# Altium project ECS_V1.06.PrjPcb
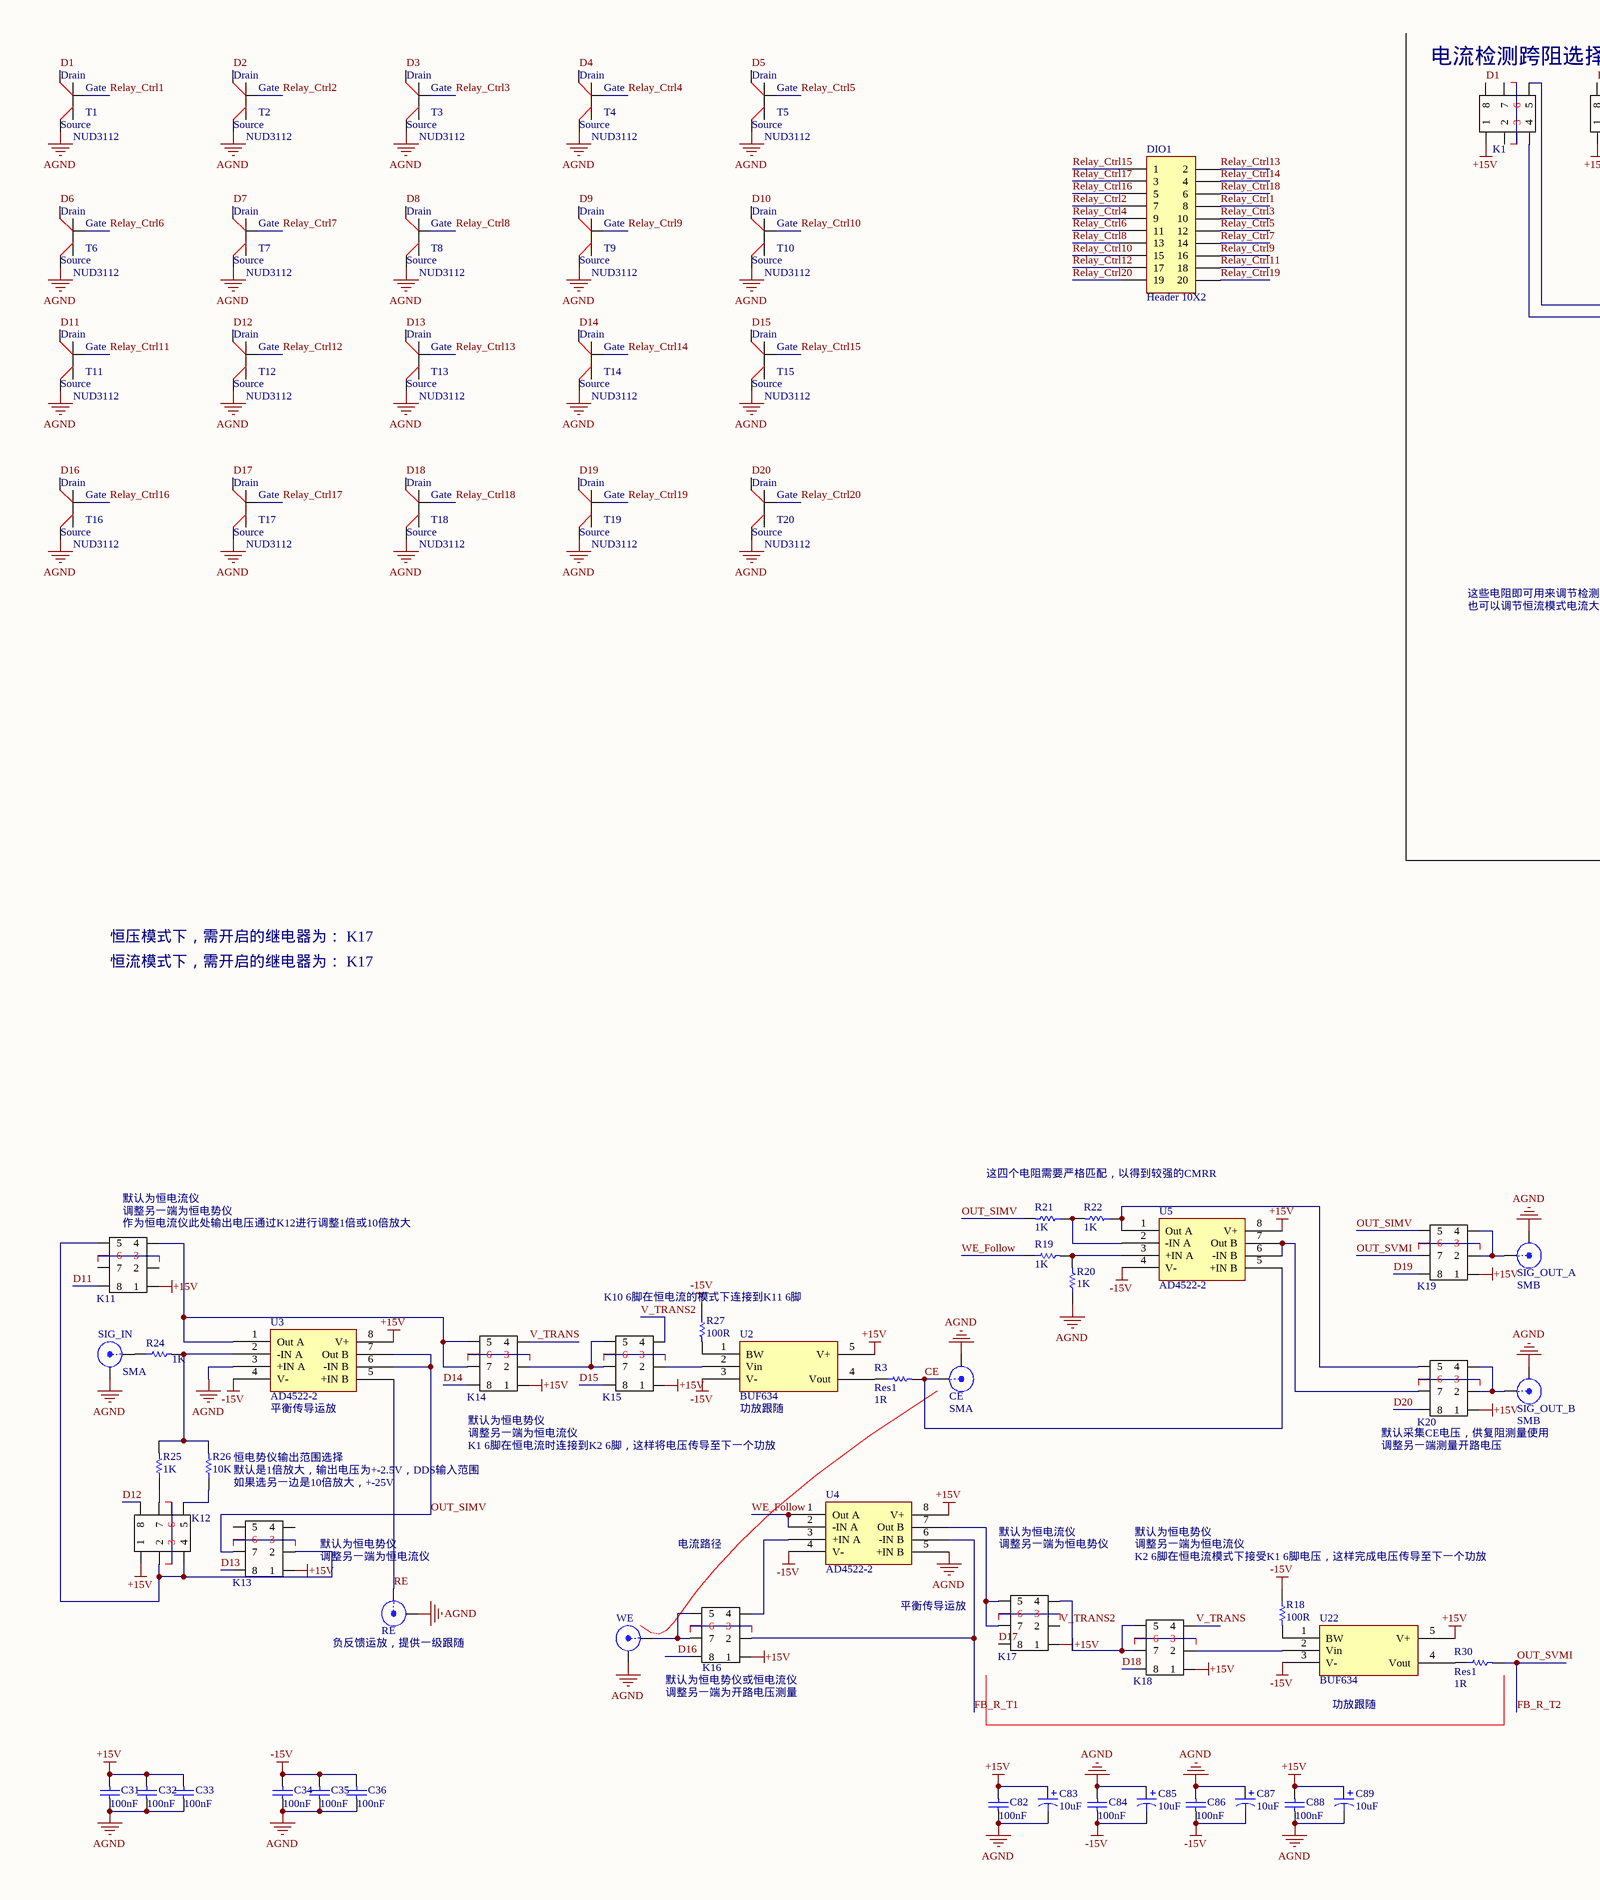
[diagram p0: Analog.SchDoc, left]
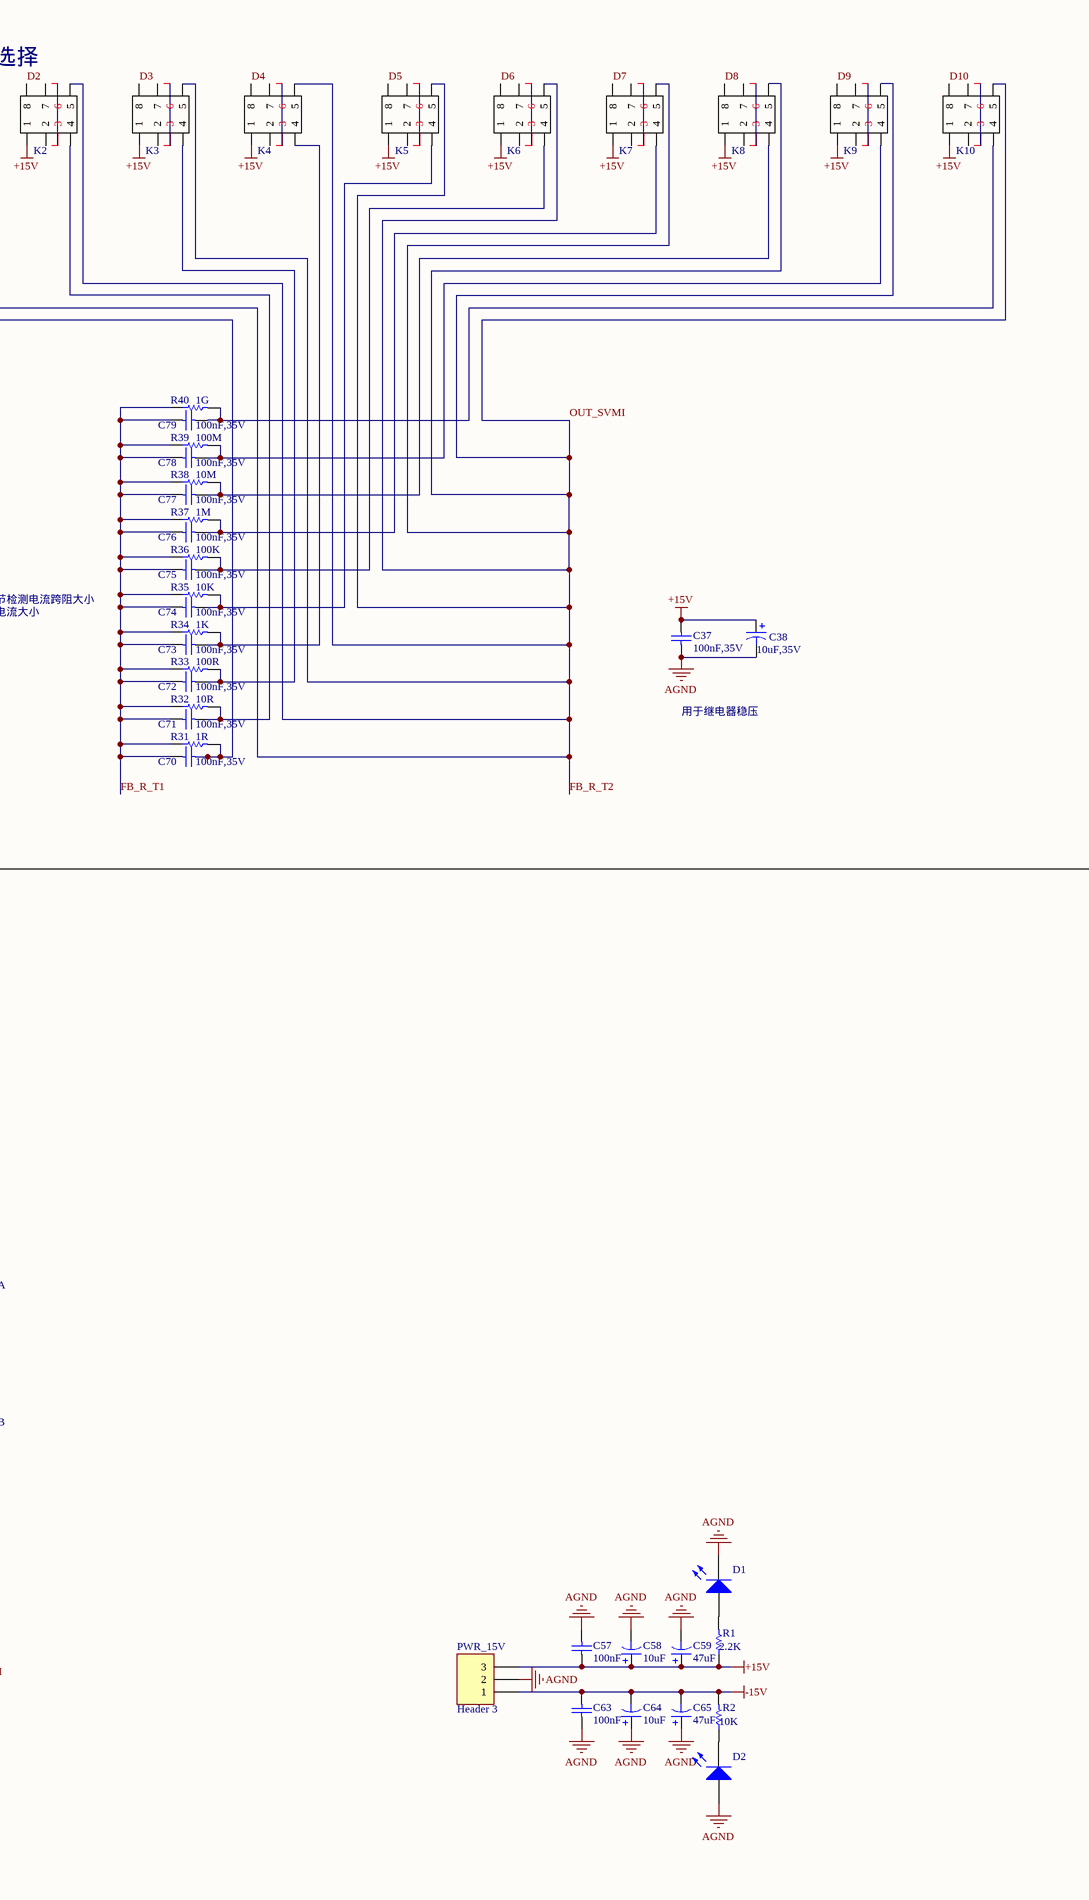
[diagram p1: Analog.SchDoc, right]
1 sheet, 110 parts. Net scope: global (net labels, ports and power ports of the same name join across sheets).
Board file: ECS_V1.06.PcbDoc

## Sheet Analog.SchDoc
size A2

### Parts
C31  100nF  [0805]
C32  100nF  [0805]
C33  100nF  [0805]
C34  100nF  [0805]
C35  100nF  [0805]
C36  100nF  [0805]
C37  value 100nF,35V  [0805]  (hidden comment: Cap)
C38  value 10uF,35V  [6032_pol]  (hidden comment: Cap Pol1)
C57  100nF  [0805]
C58  value 10uF  [6032_pol]  (hidden comment: 10uF,50V)
C59  value 47uF  [cap_pol_8*10.2]  (hidden comment: 47uF,50V)
C63  100nF  [0805]
C64  value 10uF  [6032_pol]  (hidden comment: 10uF,50V)
C65  value 47uF  [cap_pol_8*10.2]  (hidden comment: 47uF,50V)
C70  value 100nF,35V  [0805]  (hidden comment: Cap)
C71  value 100nF,35V  [0805]  (hidden comment: Cap)
C72  value 100nF,35V  [0805]  (hidden comment: Cap)
C73  value 100nF,35V  [0805]  (hidden comment: Cap)
C74  value 100nF,35V  [0805]  (hidden comment: Cap)
C75  value 100nF,35V  [0805]  (hidden comment: Cap)
C76  value 100nF,35V  [0805]  (hidden comment: Cap)
C77  value 100nF,35V  [0805]  (hidden comment: Cap)
C78  value 100nF,35V  [0805]  (hidden comment: Cap)
C79  value 100nF,35V  [0805]  (hidden comment: Cap)
C82  100nF  [0805]
C83  10uF  [6032_pol]
C84  100nF  [0805]
C85  10uF  [6032_pol]
C86  100nF  [0805]
C87  10uF  [6032_pol]
C88  100nF  [0805]
C89  10uF  [6032_pol]
CE  SMA  [SMA_SMT]
D1  LED3  [0805_pol1]  (value not drawn)
D2  LED3  [0805_pol1]  (value not drawn)
DIO1  Header 10X2  [HDR2X10]
K1  AXICOM IM  [AXICOM_IM06]  (value not drawn)
K2  AXICOM IM  [AXICOM_IM06]  (value not drawn)
K3  AXICOM IM  [AXICOM_IM06]  (value not drawn)
K4  AXICOM IM  [AXICOM_IM06]  (value not drawn)
K5  AXICOM IM  [AXICOM_IM06]  (value not drawn)
K6  AXICOM IM  [AXICOM_IM06]  (value not drawn)
K7  AXICOM IM  [AXICOM_IM06]  (value not drawn)
K8  AXICOM IM  [AXICOM_IM06]  (value not drawn)
K9  AXICOM IM  [AXICOM_IM06]  (value not drawn)
K10  AXICOM IM  [AXICOM_IM06]  (value not drawn)
K11  AXICOM IM  [AXICOM_IM06]  (value not drawn)
K12  AXICOM IM  [AXICOM_IM06]  (value not drawn)
K13  AXICOM IM  [AXICOM_IM06]  (value not drawn)
K14  AXICOM IM  [AXICOM_IM06]  (value not drawn)
K15  AXICOM IM  [AXICOM_IM06]  (value not drawn)
K16  AXICOM IM  [AXICOM_IM06]  (value not drawn)
K17  AXICOM IM  [AXICOM_IM06]  (value not drawn)
K18  AXICOM IM  [AXICOM_IM06]  (value not drawn)
K19  AXICOM IM  [AXICOM_IM06]  (value not drawn)
K20  AXICOM IM  [AXICOM_IM06]  (value not drawn)
PWR_15V  Header 3  [PWR_3T]
R1  value 2.2K  [0603]  (hidden comment: 10K)
R2  value 10K  [0603]  (hidden comment: 2.2K)
R3  Res1  value 1R  [1206]
R18  value 100R  [0805]  (hidden comment: Res1)
R19  value 1K  [0805]  (hidden comment: Res1)
R20  value 1K  [0805]  (hidden comment: Res1)
R21  value 1K  [0805]  (hidden comment: Res1)
R22  value 1K  [0805]  (hidden comment: Res1)
R24  value 1K  [0805]  (hidden comment: Res1)
R25  value 1K  [0805]  (hidden comment: Res1)
R26  value 10K  [0805]  (hidden comment: Res1)
R27  value 100R  [0805]  (hidden comment: Res1)
R30  Res1  value 1R  [1206]
R31  value 1R  [0805]  (hidden comment: Res1)
R32  value 10R  [0805]  (hidden comment: Res1)
R33  value 100R  [0805]  (hidden comment: Res1)
R34  value 1K  [0805]  (hidden comment: Res1)
R35  value 10K  [0805]  (hidden comment: Res1)
R36  value 100K  [0805]  (hidden comment: Res1)
R37  value 1M  [0805]  (hidden comment: Res1)
R38  value 10M  [0805]  (hidden comment: Res1)
R39  value 100M  [0805]  (hidden comment: Res1)
R40  value 1G  [0805]  (hidden comment: Res1)
RE  SMB  [SMA_SMT]  (value not drawn)
SIG_IN  SMA  [SMA_SMT]
SIG_OUT_A  SMB  [SMA_SMT]
SIG_OUT_B  SMB  [SMA_SMT]
T1  NUD3112  [SOT-23]
T2  NUD3112  [SOT-23]
T3  NUD3112  [SOT-23]
T4  NUD3112  [SOT-23]
T5  NUD3112  [SOT-23]
T6  NUD3112  [SOT-23]
T7  NUD3112  [SOT-23]
T8  NUD3112  [SOT-23]
T9  NUD3112  [SOT-23]
T10  NUD3112  [SOT-23]
T11  NUD3112  [SOT-23]
T12  NUD3112  [SOT-23]
T13  NUD3112  [SOT-23]
T14  NUD3112  [SOT-23]
T15  NUD3112  [SOT-23]
T16  NUD3112  [SOT-23]
T17  NUD3112  [SOT-23]
T18  NUD3112  [SOT-23]
T19  NUD3112  [SOT-23]
T20  NUD3112  [SOT-23]
U2  BUF634  [PSFM-T5]
U3  AD4522-2  [SO-8N]
U4  AD4522-2  [SO-8N]
U5  AD4522-2  [SO-8N]
U22  BUF634  [PSFM-T5]
WE  SMB  [SMA_SMT]  (value not drawn)

### Nets
+15V: C31.2 C32.2 C33.2 C37.2 C38.1 C57.2 C58.1 C59.1 C82.2 C83.1 C88.2 C89.1 K1.1 K2.1 K3.1 K4.1 K5.1 K6.1 K7.1 K8.1 K9.1 K10.1 K11.1 K12.1 K13.1 K14.1 K15.1 K16.1 K17.1 K18.1 K19.1 K20.1 PWR_15V.3 R1.1 U2.5(V+) U3.8(V+) U4.8(V+) U5.8(V+) U22.5(V+)
-15V: C34.2 C35.2 C36.2 C63.1 C64.2 C65.2 C84.1 C85.2 C86.1 C87.2 PWR_15V.1 R2.2 R18.1 R27.1 U2.3(V-) U3.4(V-) U4.4(V-) U5.4(V-) U22.3(V-)
AGND: C31.1 C32.1 C33.1 C34.1 C35.1 C36.1 C37.1 C38.2 C57.1 C58.2 C59.2 C63.2 C64.1 C65.1 C82.1 C83.2 C84.2 C85.1 C86.2 C87.1 C88.1 C89.2 CE.2(Y) D1.2(K) D2.1(A) PWR_15V.2 R20.1 RE.2(Y) SIG_IN.2(Y) SIG_OUT_A.2(Y) SIG_OUT_B.2(Y) T1.2(Source) T2.2(Source) T3.2(Source) T4.2(Source) T5.2(Source) T6.2(Source) T7.2(Source) T8.2(Source) T9.2(Source) T10.2(Source) T11.2(Source) T12.2(Source) T13.2(Source) T14.2(Source) T15.2(Source) T16.2(Source) T17.2(Source) T18.2(Source) T19.2(Source) T20.2(Source) U3.3(+IN_A) U4.5(+IN_B) WE.2(Y)
CE: CE.1(X) R3.2 U5.5(+IN_B)
D1: K1.8 T1.3(Drain)
D2: K2.8 T2.3(Drain)
D3: K3.8 T3.3(Drain)
D4: K4.8 T4.3(Drain)
D5: K5.8 T5.3(Drain)
D6: K6.8 T6.3(Drain)
D7: K7.8 T7.3(Drain)
D8: K8.8 T8.3(Drain)
D9: K9.8 T9.3(Drain)
D10: K10.8 T10.3(Drain)
D11: K11.8 T11.3(Drain)
D12: K12.8 T12.3(Drain)
D13: K13.8 T13.3(Drain)
D14: K14.8 T14.3(Drain)
D15: K15.8 T15.3(Drain)
D16: K16.8 T16.3(Drain)
D17: K17.8 T17.3(Drain)
D18: K18.8 T18.3(Drain)
D19: K19.8 T19.3(Drain)
D20: K20.8 T20.3(Drain)
FB_R_T1: C70.1 C71.1 C72.1 C73.1 C74.1 C75.1 C76.1 C77.1 C78.1 C79.1 K16.2 R31.1 R32.1 R33.1 R34.1 R35.1 R36.1 R37.1 R38.1 R39.1 R40.1 U4.6(-IN_B)
FB_R_T2: K1.5 K2.5 K3.5 K4.5 K5.5 K6.5 K7.5 K8.5 K9.5 K10.5 K19.7 R30.2  [also labelled OUT_SVMI]
OUT_SIMV: K13.7 K19.5 R21.2 U3.6(-IN_B) U3.7(Out_B)
RE: RE.1(X) U3.5(+IN_B)
Relay_Ctrl1: DIO1.8 T1.1(Gate)
Relay_Ctrl2: DIO1.7 T2.1(Gate)
Relay_Ctrl3: DIO1.10 T3.1(Gate)
Relay_Ctrl4: DIO1.9 T4.1(Gate)
Relay_Ctrl5: DIO1.12 T5.1(Gate)
Relay_Ctrl6: DIO1.11 T6.1(Gate)
Relay_Ctrl7: DIO1.14 T7.1(Gate)
Relay_Ctrl8: DIO1.13 T8.1(Gate)
Relay_Ctrl9: DIO1.16 T9.1(Gate)
Relay_Ctrl10: DIO1.15 T10.1(Gate)
Relay_Ctrl11: DIO1.18 T11.1(Gate)
Relay_Ctrl12: DIO1.17 T12.1(Gate)
Relay_Ctrl13: DIO1.2 T13.1(Gate)
Relay_Ctrl14: DIO1.4 T14.1(Gate)
Relay_Ctrl15: DIO1.1 T15.1(Gate)
Relay_Ctrl16: DIO1.5 T16.1(Gate)
Relay_Ctrl17: DIO1.3 T17.1(Gate)
Relay_Ctrl18: DIO1.6 T18.1(Gate)
Relay_Ctrl19: DIO1.20 T19.1(Gate)
Relay_Ctrl20: DIO1.19 T20.1(Gate)
V_TRANS: K14.4 K18.4
V_TRANS2: K15.4 K17.2
WE_Follow: R19.1 U4.1(Out_A) U4.2(-IN_A)
NetC70_2: C70.2 K1.4 R31.2
NetC71_2: C71.2 K2.4 R32.2
NetC72_2: C72.2 K3.4 R33.2
NetC73_2: C73.2 K4.4 R34.2
NetC74_2: C74.2 K5.4 R35.2
NetC75_2: C75.2 K6.4 R36.2
NetC76_2: C76.2 K7.4 R37.2
NetC77_2: C77.2 K8.4 R38.2
NetC78_2: C78.2 K9.4 R39.2
NetC79_2: C79.2 K10.4 R40.2
NetD1_1: D1.1(A) R1.2
NetD2_2: D2.2(K) R2.1
NetK1_3: K1.3 K1.6
NetK2_3: K2.3 K2.6
NetK3_3: K3.3 K3.6
NetK4_3: K4.3 K4.6
NetK5_3: K5.3 K5.6
NetK6_3: K6.3 K6.6
NetK7_3: K7.3 K7.6
NetK8_3: K8.3 K8.6
NetK9_3: K9.3 K9.6
NetK10_3: K10.3 K10.6
NetK11_3: K11.3 K11.6
NetK11_4: K11.4 K14.5 K14.7 U3.1(Out_A)
NetK11_5: K11.5 K12.2 K12.4 K13.2
NetK12_3: K12.3 K12.6
NetK12_5: K12.5 R26.1
NetK12_7: K12.7 R25.1
NetK13_3: K13.3 K13.6
NetK14_2: K14.2 K15.5 K15.7
NetK14_3: K14.3 K14.6
NetK15_2: K15.2 U2.2(Vin)
NetK15_3: K15.3 K15.6
NetK16_3: K16.3 K16.6
NetK16_4: K16.4 U4.3(+IN_A)
NetK16_5: K16.5 K16.7 WE.1(X)
NetK17_3: K17.3 K17.6
NetK17_4: K17.4 K18.5 K18.7
NetK17_5: K17.5 K17.7 U4.7(Out_B)
NetK18_2: K18.2 U22.2(Vin)
NetK18_3: K18.3 K18.6
NetK19_2: K19.2 K19.4 SIG_OUT_A.1(X)
NetK19_3: K19.3 K19.6
NetK20_2: K20.2 K20.4 SIG_OUT_B.1(X)
NetK20_3: K20.3 K20.6
NetK20_5: K20.5 R22.1 U5.1(Out_A)
NetK20_7: K20.7 U5.6(-IN_B) U5.7(Out_B)
NetR3_1: R3.1 U2.4(Vout)
NetR18_2: R18.2 U22.1(BW)
NetR19_2: R19.2 R20.2 U5.3(+IN_A)
NetR21_1: R21.1 R22.2 U5.2(-IN_A)
NetR24_1: R24.1 SIG_IN.1(X)
NetR24_2: R24.2 R25.2 R26.2 U3.2(-IN_A)
NetR27_2: R27.2 U2.1(BW)
NetR30_1: R30.1 U22.4(Vout)

Not connected (* = marked no-connect by the designer): K1 2 7; K2 2 7; K3 2 7; K4 2 7; K5 2 7; K6 2 7; K7 2 7; K8 2 7; K9 2 7; K10 2 7; K11 2 7; K13 4 5

### Notes on the sheet
- (near K1) 电流检测跨阻选择
- 这些电阻即可用来调节检测电流跨阻大小
- 也可以调节恒流模式电流大小
- 用于继电器稳压
- 恒压模式下，需开启的继电器为： K17
- 恒流模式下，需开启的继电器为： K17
- (near K11) 默认为恒电流仪
- (near K11) 调整另一端为恒电势仪
- 这四个电阻需要严格匹配，以得到较强的CMRR
- (near K11) 作为恒电流仪此处输出电压通过K12进行调整1倍或10倍放大
- (near R27) K10 6脚在恒电流的模式下连接到K11 6脚
- (near R26) 恒电势仪输出范围选择
- (near U3) 平衡传导运放
- (near K14) 默认为恒电势仪
- (near K14) 调整另一端为恒电流仪
- K1 6脚在恒电流时连接到K2 6脚，这样将电压传导至下一个功放
- (near U2) 功放跟随
- (near K20) 默认采集CE电压，供复阻测量使用
- (near K20) 调整另一端测量开路电压
- (near R26) 默认是1倍放大，输出电压为+-2.5V，DDS输入范围
- 如果选另一边是10倍放大，+-25V
- (near K13) 默认为恒电势仪
- 调整另一端为恒电流仪
- 电流路径
- 默认为恒电流仪
- 调整另一端为恒电势仪
- 默认为恒电势仪
- (near R18) K2 6脚在恒电流模式下接受K1 6脚电压，这样完成电压传导至下一个功放
- (near RE) 负反馈运放，提供一级跟随
- 平衡传导运放
- (near K16) 默认为恒电势仪或恒电流仪
- 调整另一端为开路电压测量
- (near U22) 功放跟随

### Library data of the parts
C31-C36 C82 C84 C86 C88 = Cap: Capacitor; Value: 100nF,35V; Published: 8-Jun-2000; LatestRevisionDate: 17-Jul-2002; LatestRevisionNote: Re-released for DXP Platform.; PackageReference: RAD-0.3; Publisher: Altium Limited; PackageDescription: Radial Cap, Thru-Hole; 2 Leads; 0.3 in Pin Spacing
C37 C70-C79 = Cap: Capacitor; Published: 8-Jun-2000; LatestRevisionDate: 17-Jul-2002; LatestRevisionNote: Re-released for DXP Platform.; PackageReference: RAD-0.3; Publisher: Altium Limited; PackageDescription: Radial Cap, Thru-Hole; 2 Leads; 0.3 in Pin Spacing
C38 C58 C59 C64 C65 = Cap Pol1: Polarized Capacitor (Radial); Published: 8-Jun-2000; LatestRevisionDate: 17-Jul-2002; LatestRevisionNote: Re-released for DXP Platform.; PackageReference: RB7.6-15; Publisher: Altium Limited; PackageDescription: Polarized Capacitor (Radial); 2 Leads
C57 C63 = Cap: Capacitor,100V; Value: 1uF; Published: 8-Jun-2000; LatestRevisionDate: 17-Jul-2002; LatestRevisionNote: Re-released for DXP Platform.; PackageReference: RAD-0.3; Publisher: Altium Limited; PackageDescription: Radial Cap, Thru-Hole; 2 Leads; 0.3 in Pin Spacing
C83 C85 C87 C89 = Cap Pol1: Polarized Capacitor (Radial); Value: 10uF,35V; Published: 8-Jun-2000; LatestRevisionDate: 17-Jul-2002; LatestRevisionNote: Re-released for DXP Platform.; PackageReference: RB7.6-15; Publisher: Altium Limited; PackageDescription: Polarized Capacitor (Radial); 2 Leads
CE RE SIG_IN SIG_OUT_A SIG_OUT_B WE = SMB: SMB Straight Connector; LatestRevisionDate: 17-Jul-2002; LatestRevisionNote: Re-released for DXP Platform.; Publisher: Altium Limited
D1 D2 = LED3: Typical BLUE SiC LED; Published: 8-Jun-2000; LatestRevisionDate: 17-Dec-2003; LatestRevisionNote: PCB Footprint replaced.; DatasheetVersion: 16-Apr-2002; PackageVersion: 16-Apr-2002; PackageReference: 3.5X2.8X1.9; Publisher: Altium Limited
DIO1 = Header 10X2: Header, 10-Pin, Dual row; LatestRevisionDate: 17-Jul-2002; LatestRevisionNote: Re-released for DXP Platform.; Publisher: Altium Limited
K1-K20 = AXiCOM IM05
PWR_15V = Header 3: Header, 3-Pin; LatestRevisionDate: 17-Jul-2002; LatestRevisionNote: Re-released for DXP Platform.; Publisher: Altium Limited
R1-R3 R18-R22 R24-R27 R30-R40 = Res1: Resistor; Published: 8-Jun-2000; LatestRevisionDate: 17-Jul-2002; LatestRevisionNote: Re-released for DXP Platform.; PackageReference: AXIAL-0.3; Publisher: Altium Limited
  R3 R18-R22 R24-R27 R30-R40: PackageDescription: Axial Device, Thru-Hole; 2 Leads; 0.3 in Pin Spacing
T1-T20 = NUD3105: Relay Driver 5V Supply; manufactor: On Semiconductor
U2 U22 = BUF634: Manufacture: TI
U3-U5 = AD8676